# Altium schematic sheet MCU.SchDoc
size A4; SheetNumber: 2; SheetTotal: 2
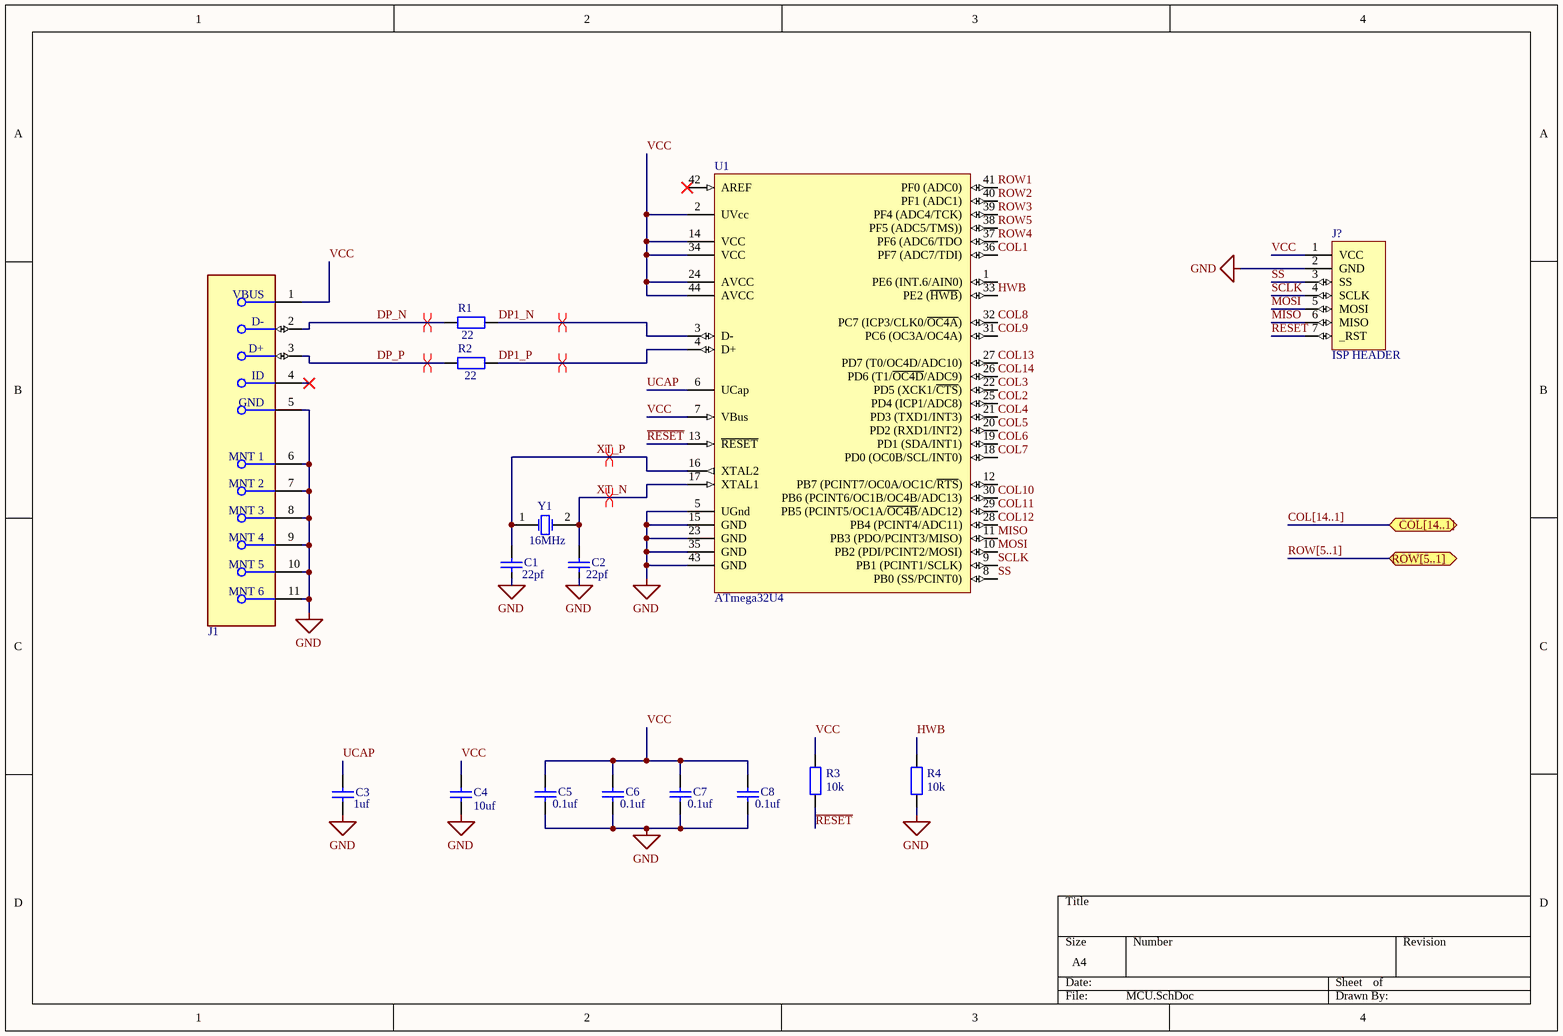
[diagram p0: MCU.SchDoc]

## Parts
C1  value 22pf  [0805]  (hidden comment: Cap)
C2  value 22pf  [0805]  (hidden comment: Cap)
C3  value 1uf  [0805]  (hidden comment: Cap)
C4  value 10uf  [0805]  (hidden comment: Cap)
C5  value 0.1uf  [0805]  (hidden comment: Cap)
C6  value 0.1uf  [0805]  (hidden comment: Cap)
C7  value 0.1uf  [0805]  (hidden comment: Cap)
C8  value 0.1uf  [0805]  (hidden comment: Cap)
J1  Molex 473460001  [Molex 47346 0001]  (value not drawn)
J?  ISP HEADER  [Spi header]
R1  value 22  [0805]  (hidden comment: Res)
R2  value 22  [0805]  (hidden comment: Res)
R3  value 10k  [0805]  (hidden comment: Res)
R4  value 10k  [0805]  (hidden comment: Res)
U1  ATmega32U4  [TQFP44]
Y1  value 16MHz  [ABM3]  (hidden comment: XTAL)

## Ports
COL[14..1] (bidir), ROW[5..1] (bidir)

## Nets
GND: C1.1 C2.1 C3.1 C4.1 C5.1 C6.1 C7.1 C8.1 J1.5(GND) J1.6(MNT_1) J1.7(MNT_2) J1.8(MNT_3) J1.9(MNT_4) J1.10(MNT_5) J1.11(MNT_6) J?.2(GND) R4.2 U1.5(UGnd) U1.15(GND) U1.23(GND) U1.35(GND) U1.43(GND)
~{RESET}: J?.7(_RST) R3.2 U1.13(~{RESET})
COL1: U1.36(PF7_(ADC7/TDI))
COL2: U1.25(PD4_(ICP1/ADC8))
COL3: U1.22(PD5_(XCK1/~{CTS}))
COL4: U1.21(PD3_(TXD1/INT3))
COL5: U1.20(PD2_(RXD1/INT2))
COL6: U1.19(PD1_(SDA/INT1))
COL7: U1.18(PD0_(OC0B/SCL/INT0))
COL8: U1.32(PC7_(ICP3/CLK0/~{OC4A}))
COL9: U1.31(PC6_(OC3A/OC4A))
COL10: U1.30(PB6_(PCINT6/OC1B/OC4B/ADC13))
COL11: U1.29(PB5_(PCINT5/OC1A/~{OC4B}/ADC12))
COL12: U1.28(PB4_(PCINT4/ADC11))
COL13: U1.27(PD7_(T0/OC4D/ADC10))
COL14: U1.26(PD6_(T1/~{OC4D}/ADC9))
DP1_N: R1.2 U1.3(D-)
DP1_P: R2.2 U1.4(D+)
DP_N: J1.2(D-) R1.1
DP_P: J1.3(D+) R2.1
HWB: R4.1 U1.33(PE2_(~{HWB}))
MISO: J?.6(MISO) U1.11(PB3_(PDO/PCINT3/MISO))
MOSI: J?.5(MOSI) U1.10(PB2_(PDI/PCINT2/MOSI))
ROW1: U1.41(PF0_(ADC0))
ROW2: U1.40(PF1_(ADC1))
ROW3: U1.39(PF4_(ADC4/TCK))
ROW4: U1.37(PF6_(ADC6/TDO)
ROW5: U1.38(PF5_(ADC5/TMS)))
SCLK: J?.4(SCLK) U1.9(PB1_(PCINT1/SCLK))
SS: J?.3(SS) U1.8(PB0_(SS/PCINT0))
UCAP: C3.2 U1.6(UCap)
VCC: C4.2 C5.2 C6.2 C7.2 C8.2 J1.1(VBUS) J?.1(VCC) R3.1 U1.2(UVcc) U1.7(VBus) U1.14(VCC) U1.24(AVCC) U1.34(VCC) U1.44(AVCC)
XT_N: C2.2 U1.17(XTAL1) Y1.2(OSC2)
XT_P: C1.2 U1.16(XTAL2) Y1.1(OSC1)

Not connected (* = marked no-connect by the designer): J1 4(ID)*; U1 1(PE6_(INT.6/AIN0)) 12(PB7_(PCINT7/OC0A/OC1C/~{RTS})) 42(AREF)*

## Buses and harness runs
bus COL[14..1] = port COL[14..1]
bus ROW[5..1] = port ROW[5..1]

## Layout directives
differential pair: DP1_N, DP1_P, DP_N, DP_P, XT_N, XT_P

## Library data of the parts
C1-C8 = Cap: Capacitor
J1 = Molex 473460001: Micro usb receptacle
R1-R4 = Res: Resistor
  R1: Published: 8-Jun-2000; LatestRevisionDate: 17-Jul-2002; LatestRevisionNote: Re-released for DXP Platform.; PackageReference: AXIAL-0.4; Publisher: Altium Limited; PackageDescription: Axial Device, Thru-Hole; 2 Leads; 0.4 in Pin Spacing
U1 = ATmega32U4: 8-bit AVR Microcontroller; Manufacturer: Microchip / Atmel; Manufacturer Part Number: ATMEGA32U4-AU; RevisionNote: DatasheetVersion updated. URLs added.; ComponentLink1Description: Manufacturer URL; PackageDescription: 44-Pin Plastic Thin Quad Flat Pack, 10 x 10 x 1.0 mm Body, 0.8 mm Pitch (TQFP); DatasheetVersion: revF, Nov-2010; ComponentLink2URL: http://www.atmel.com/dyn/resources/prod_documents/doc7766.pdf; ComponentLink1URL: http://www.atmel.com/; PackageReference: 44ML; ComponentLink2Description: ATmega16U4/32U4 Datasheet; PackageVersion: rev.G, Jul-2007; ComponentLink3URL: http://www.atmel.com/dyn/resources/prod_documents/7766S.pdf; ComponentLink3Description: ATmega16U4 ATmega32U4 Summary
Y1 = XTAL: Crystal Oscillator